# Altium project Pre_Amplifier.PrjPcb
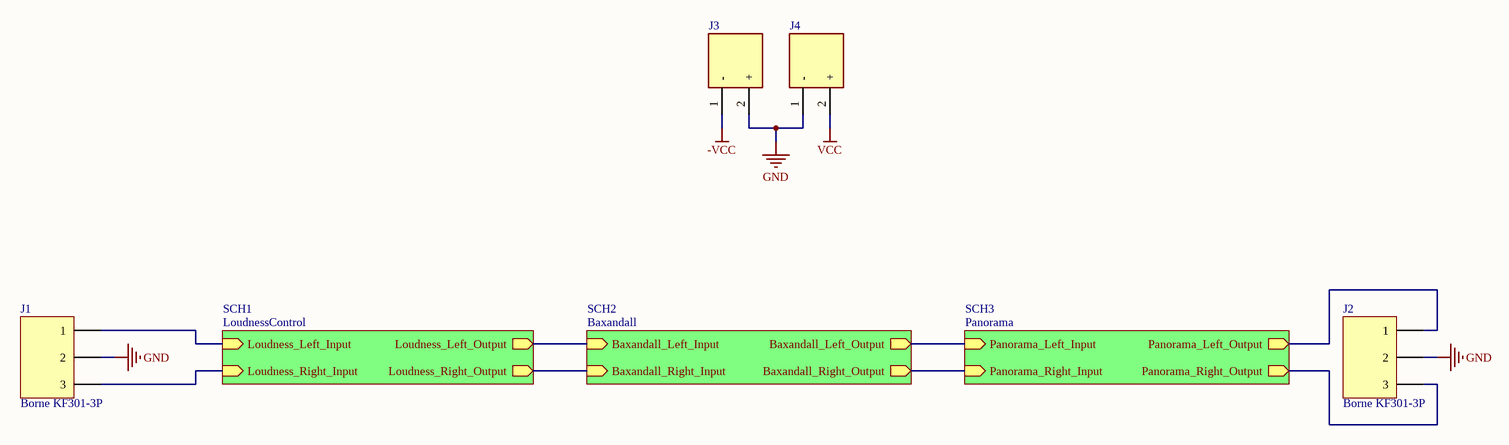
[diagram p0: Schematic.SchDoc]
4 sheets, 49 parts. Net scope: hierarchical (ports join the sheet entries above them; power ports are global).
Board file: PCB.PcbDoc
Sheets:
  Schematic.SchDoc
    SCH1 = LoudnessControl.SchDoc
    SCH2 = Baxandall.SchDoc
    SCH3 = Panorama.SchDoc

## Sheet Schematic.SchDoc
size A4; SheetNumber: 1; SheetTotal: 4

### Parts
J1  Borne KF301-3P  [Borne KF301-3P]
J2  Borne KF301-3P  [Borne KF301-3P]
J3  Borne KF301-2P  [Borne KF301-2P]  (value not drawn)
J4  Borne KF301-2P  [Borne KF301-2P]  (value not drawn)

### Sub-sheets
SCH1 = LoudnessControl: Loudness_Left_Input (in), Loudness_Right_Input (in), Loudness_Left_Output (out), Loudness_Right_Output (out)
SCH2 = Baxandall: Baxandall_Left_Input (in), Baxandall_Right_Input (in), Baxandall_Left_Output (out), Baxandall_Right_Output (out)
SCH3 = Panorama: Panorama_Left_Input (in), Panorama_Right_Input (in), Panorama_Left_Output (out), Panorama_Right_Output (out)

### Nets
-VCC: J3.1(-)
GND: J1.2 J2.2 J3.2(+) J4.1(-)
VCC: J4.2(+)
Baxandall_Left_Output: sheet SCH2/Baxandall_Left_Output, sheet SCH3/Panorama_Left_Input
Baxandall_Right_Output: sheet SCH2/Baxandall_Right_Output, sheet SCH3/Panorama_Right_Input
Loudness_Left_Input: J1.1 ; sheet SCH1/Loudness_Left_Input
Loudness_Right_Input: J1.3 ; sheet SCH1/Loudness_Right_Input
NetJ2_1: J2.1 ; sheet SCH3/Panorama_Left_Output
NetJ2_3: J2.3 ; sheet SCH3/Panorama_Right_Output
NetOPAMP3_1: sheet SCH1/Loudness_Left_Output, sheet SCH2/Baxandall_Left_Input
NetOPAMP3_6: sheet SCH1/Loudness_Right_Output, sheet SCH2/Baxandall_Right_Input

### Library data of the parts
J3 J4 = Borne KF301-2P: 2 Pin Terminal Block 5mm Pitch; Price: None; Value: *; MP: KF301-2P; Package: None; Availability: Unavailable

## Sheet LoudnessControl.SchDoc
size A4; SheetNumber: 2; SheetTotal: 4
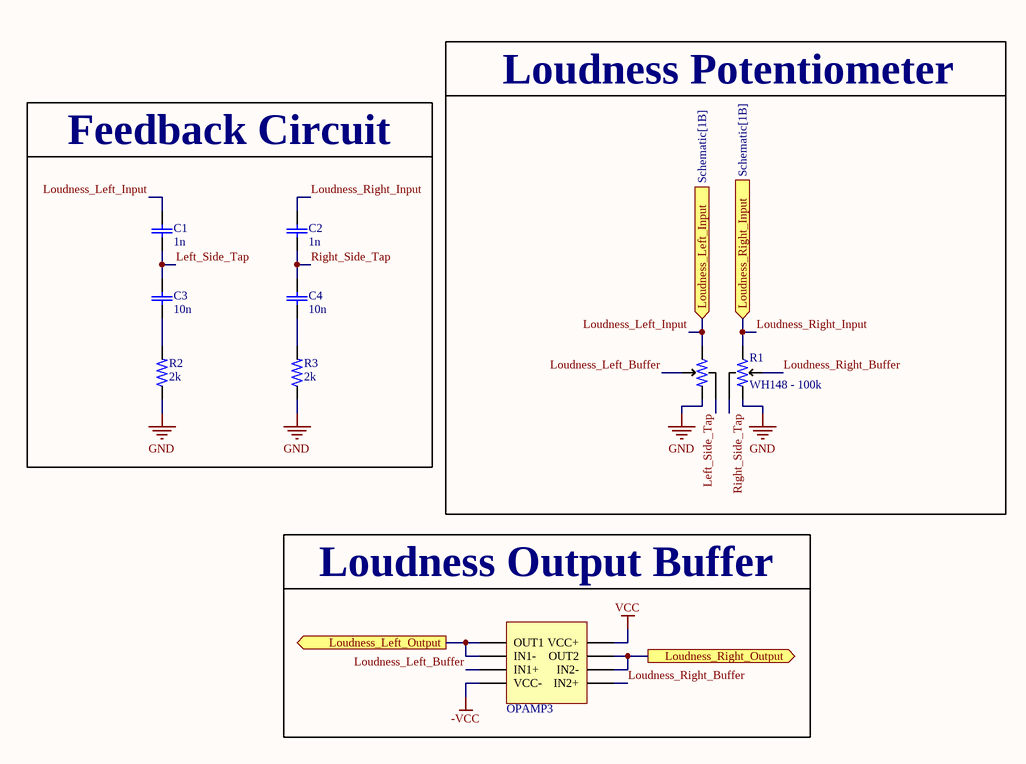
[diagram p1: LoudnessControl.SchDoc]

### Parts
C1  1n  [CERAMIC0603]
C2  1n  [CERAMIC0603]
C3  10n  [CERAMIC0603]
C4  10n  [CERAMIC0603]
OPAMP3  TL072  [DIP8]  (value not drawn)
R1  WH148 - 100k  [WH148]
R2  2k  [RES0603]
R3  2k  [RES0603]

### Ports
Loudness_Left_Input (in, see Schematic[1B]), Loudness_Left_Output (out, see Schematic[2B]), Loudness_Right_Input (in, see Schematic[1B]), Loudness_Right_Output (out, see Schematic[2B])

### Nets
-VCC: OPAMP3.4(VCC-)
GND: R1.3 R1.7 R2.1 R3.1
VCC: OPAMP3.8(VCC+)
Left_Side_Tap: C1.1(C1) C3.2(C2) R1.8
Loudness_Left_Buffer: OPAMP3.3(IN1+) R1.6
Loudness_Left_Input: C1.2(C2) R1.5 ; port Loudness_Left_Input
Loudness_Right_Buffer: OPAMP3.5(IN2+) R1.2
Loudness_Right_Input: C2.2(C2) R1.1 ; port Loudness_Right_Input
Right_Side_Tap: C2.1(C1) C4.2(C2) R1.4
NetC3_1: C3.1(C1) R2.2
NetC4_1: C4.1(C1) R3.2
NetOPAMP3_1: OPAMP3.1(OUT1) OPAMP3.2(IN1-) ; port Loudness_Left_Output
NetOPAMP3_6: OPAMP3.6(IN2-) OPAMP3.7(OUT2) ; port Loudness_Right_Output

### Notes on the sheet
- Feedback Circuit
- Loudness Potentiometer
- Loudness Output Buffer

### Library data of the parts
C1-C4 = Cap: MF: KEMET; MP: TAJC226M025RNJ; SnapEDA_Link: https://www.snapeda.com/parts/TAJC226M025RNJ/KEMET/view-part/?ref=snap; Availability: In Stock; Price: None; Purchase-URL: https://pricing.snapeda.com/search/part/TAJC226M025RNJ/?ref=eda; Package: None; Check_prices: https://www.snapeda.com/parts/TAJC226M025RNJ/KEMET/view-part/?ref=eda; Value: *
R1 = WH148
R2 R3 = RESISTOR SMD: MP: 3-1879460-6; Package: None; Price: None; Value: *; Availability: Unavailable

## Sheet Baxandall.SchDoc
size A4; SheetNumber: 3; SheetTotal: 4
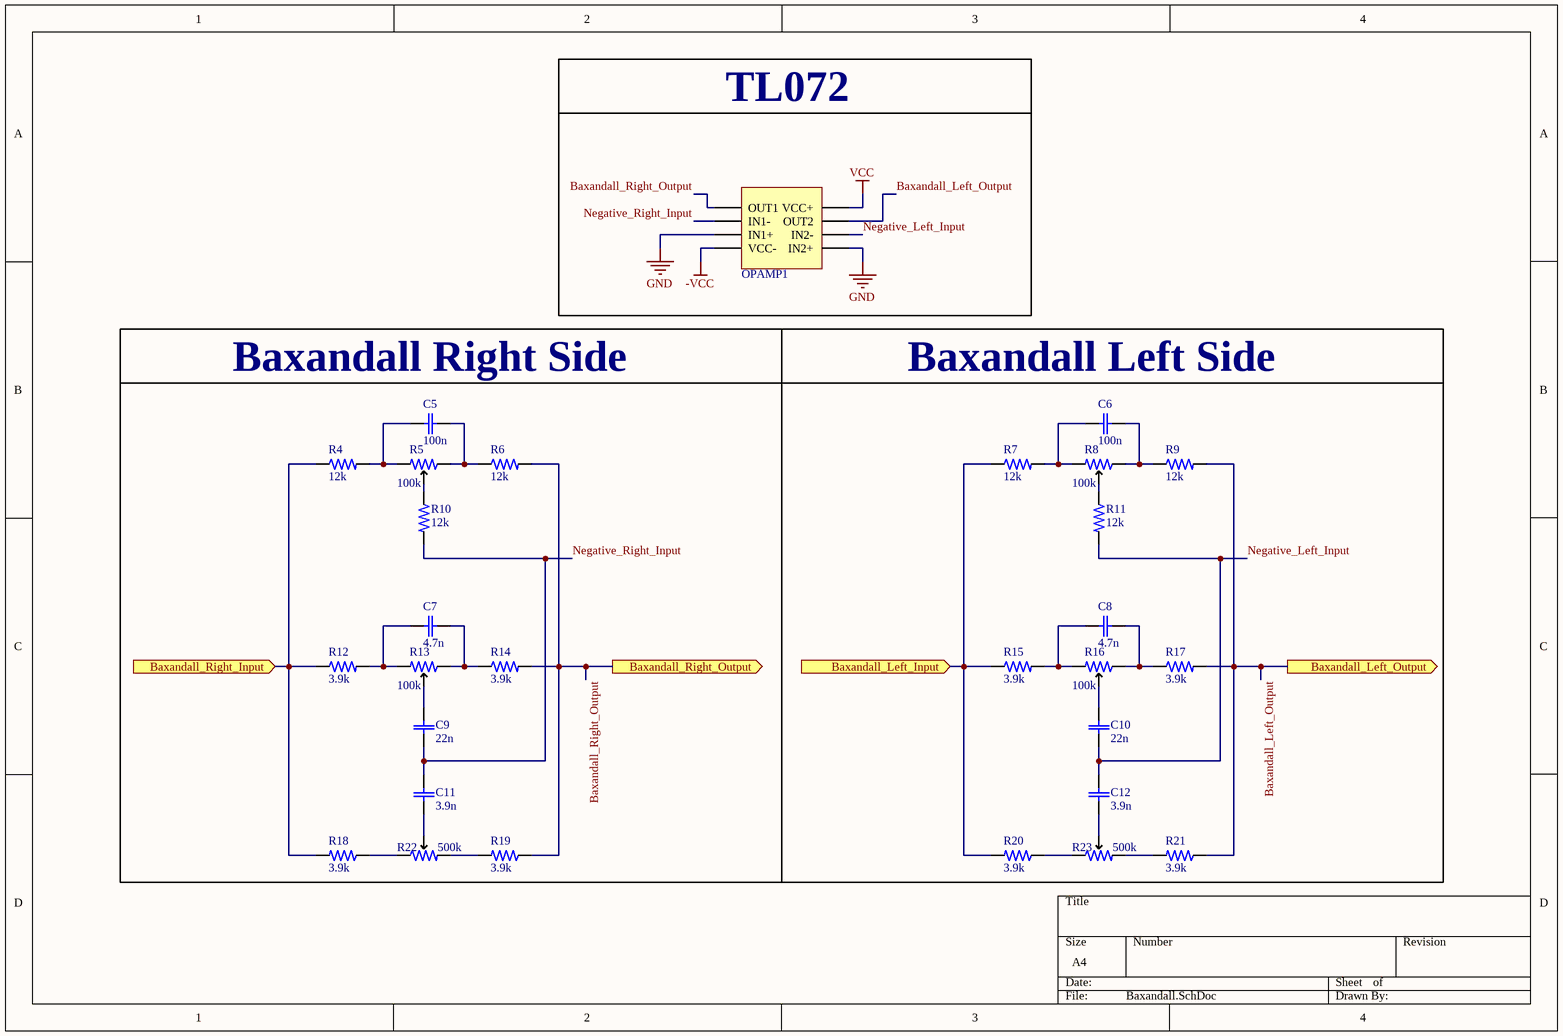
[diagram p2: Baxandall.SchDoc]

### Parts
C5  100n  [CERAMIC0603]
C6  100n  [CERAMIC0603]
C7  4.7n  [CERAMIC0603]
C8  4.7n  [CERAMIC0603]
C9  22n  [CERAMIC0603]
C10  22n  [CERAMIC0603]
C11  3.9n  [CERAMIC0603]
C12  3.9n  [CERAMIC0603]
OPAMP1  TL072  [DIP8]  (value not drawn)
R4  12k  [RES0603]
R5  100k  [Potentiometer THT]
R6  12k  [RES0603]
R7  12k  [RES0603]
R8  100k  [Potentiometer THT]
R9  12k  [RES0603]
R10  12k  [RES0603]
R11  12k  [RES0603]
R12  3.9k  [RES0603]
R13  100k  [Potentiometer THT]
R14  3.9k  [RES0603]
R15  3.9k  [RES0603]
R16  100k  [Potentiometer THT]
R17  3.9k  [RES0603]
R18  3.9k  [RES0603]
R19  3.9k  [RES0603]
R20  3.9k  [RES0603]
R21  3.9k  [RES0603]
R22  500k  [Potentiometer THT]
R23  500k  [Potentiometer THT]

### Ports
Baxandall_Left_Input (in, see Schematic[2B]), Baxandall_Left_Output (out, see Schematic[3B]), Baxandall_Right_Input (in, see Schematic[2B]), Baxandall_Right_Output (out, see Schematic[3B])

### Nets
-VCC: OPAMP1.4(VCC-)
GND: OPAMP1.3(IN1+) OPAMP1.5(IN2+)
VCC: OPAMP1.8(VCC+)
Baxandall_Left_Output: OPAMP1.7(OUT2) R9.2 R17.2 R21.1 ; port Baxandall_Left_Output
Baxandall_Right_Output: OPAMP1.1(OUT1) R6.2 R14.2 R19.1 ; port Baxandall_Right_Output
Negative_Left_Input: C10.1(C1) C12.1(C1) OPAMP1.6(IN2-) R11.2
Negative_Right_Input: C9.1(C1) C11.1(C1) OPAMP1.2(IN1-) R10.2
NetC5_1: C5.1(C1) R4.2 R5.2
NetC5_2: C5.2(C2) R5.1 R6.1
NetC6_1: C6.1(C1) R7.2 R8.2
NetC6_2: C6.2(C2) R8.1 R9.1
NetC7_1: C7.1(C1) R12.2 R13.2
NetC7_2: C7.2(C2) R13.1 R14.1
NetC8_1: C8.1(C1) R15.2 R16.2
NetC8_2: C8.2(C2) R16.1 R17.1
NetC9_2: C9.2(C2) R13.3
NetC10_2: C10.2(C2) R16.3
NetC11_2: C11.2(C2) R22.3
NetC12_2: C12.2(C2) R23.3
NetOPAMP3_1: R7.1 R15.1 R20.2 ; port Baxandall_Left_Input
NetOPAMP3_6: R4.1 R12.1 R18.2 ; port Baxandall_Right_Input
NetR5_3: R5.3 R10.1
NetR8_3: R8.3 R11.1
NetR18_1: R18.1 R22.1
NetR19_2: R19.2 R22.2
NetR20_1: R20.1 R23.1
NetR21_2: R21.2 R23.2

### Notes on the sheet
- TL072
- (near C5) Baxandall Right Side
- (near C6) Baxandall Left Side

### Library data of the parts
C5-C12 = Cap: MF: KEMET; MP: TAJC226M025RNJ; SnapEDA_Link: https://www.snapeda.com/parts/TAJC226M025RNJ/KEMET/view-part/?ref=snap; Availability: In Stock; Price: None; Purchase-URL: https://pricing.snapeda.com/search/part/TAJC226M025RNJ/?ref=eda; Package: None; Check_prices: https://www.snapeda.com/parts/TAJC226M025RNJ/KEMET/view-part/?ref=eda; Value: *
R4 R6 R7 R9-R12 R14 R15 R17-R21 = RESISTOR SMD: MP: 3-1879460-6; Package: None; Price: None; Value: *; Availability: Unavailable
R5 R8 R13 R16 R22 R23 = Potentiometer

## Sheet Panorama.SchDoc
size A4; SheetNumber: 4; SheetTotal: 4
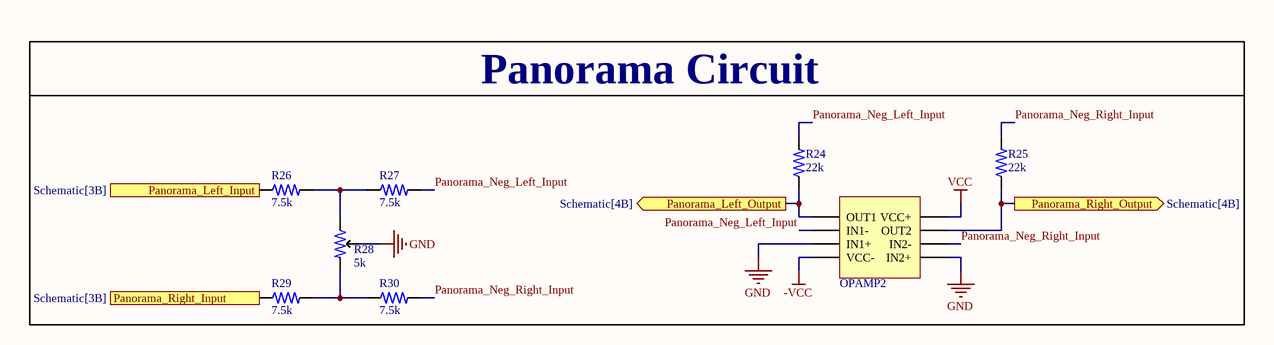
[diagram p3: Panorama.SchDoc]

### Parts
OPAMP2  TL072  [DIP8]  (value not drawn)
R24  22k  [RES0603]
R25  22k  [RES0603]
R26  7.5k  [RES0603]
R27  7.5k  [RES0603]
R28  5k  [Potentiometer THT]
R29  7.5k  [RES0603]
R30  7.5k  [RES0603]

### Ports
Panorama_Left_Input (in, see Schematic[3B]), Panorama_Left_Output (out, see Schematic[4B]), Panorama_Right_Input (in, see Schematic[3B]), Panorama_Right_Output (out, see Schematic[4B])

### Nets
-VCC: OPAMP2.4(VCC-)
GND: OPAMP2.3(IN1+) OPAMP2.5(IN2+) R28.3
VCC: OPAMP2.8(VCC+)
Baxandall_Left_Output: R26.1 ; port Panorama_Left_Input
Baxandall_Right_Output: R29.1 ; port Panorama_Right_Input
Panorama_Neg_Left_Input: OPAMP2.2(IN1-) R24.2 R27.2
Panorama_Neg_Right_Input: OPAMP2.6(IN2-) R25.2 R30.2
NetJ2_1: OPAMP2.1(OUT1) R24.1 ; port Panorama_Left_Output
NetJ2_3: OPAMP2.7(OUT2) R25.1 ; port Panorama_Right_Output
NetR26_2: R26.2 R27.1 R28.1
NetR28_2: R28.2 R29.2 R30.1

### Notes on the sheet
- Panorama Circuit

### Library data of the parts
R24-R27 R29 R30 = RESISTOR SMD: MP: 3-1879460-6; Package: None; Price: None; Value: *; Availability: Unavailable
R28 = Potentiometer

## Nets that join several sheets
-VCC: Schematic (J3.1), LoudnessControl (OPAMP3.4), Baxandall (OPAMP1.4), Panorama (OPAMP2.4)
GND: Schematic (J1.2 J2.2 J3.2 J4.1), LoudnessControl (R1.3 R1.7 R2.1 R3.1), Baxandall (OPAMP1.3 OPAMP1.5), Panorama (OPAMP2.3 OPAMP2.5 R28.3)
VCC: Schematic (J4.2), LoudnessControl (OPAMP3.8), Baxandall (OPAMP1.8), Panorama (OPAMP2.8)
Baxandall_Left_Output: Baxandall (OPAMP1.7 R9.2 R17.2 R21.1), Panorama (R26.1)
Baxandall_Right_Output: Baxandall (OPAMP1.1 R6.2 R14.2 R19.1), Panorama (R29.1)
Loudness_Left_Input: Schematic (J1.1), LoudnessControl (C1.2 R1.5)
Loudness_Right_Input: Schematic (J1.3), LoudnessControl (C2.2 R1.1)
NetJ2_1: Schematic (J2.1), Panorama (OPAMP2.1 R24.1)
NetJ2_3: Schematic (J2.3), Panorama (OPAMP2.7 R25.1)
NetOPAMP3_1: LoudnessControl (OPAMP3.1 OPAMP3.2), Baxandall (R7.1 R15.1 R20.2)
NetOPAMP3_6: LoudnessControl (OPAMP3.6 OPAMP3.7), Baxandall (R4.1 R12.1 R18.2)